# EAGLE design RetroESP32-X (EAGLE 9.6.2)

## Sheet 1 of 8: POWER (SOURCE, BATTERY, CHARGE, CONTROL)
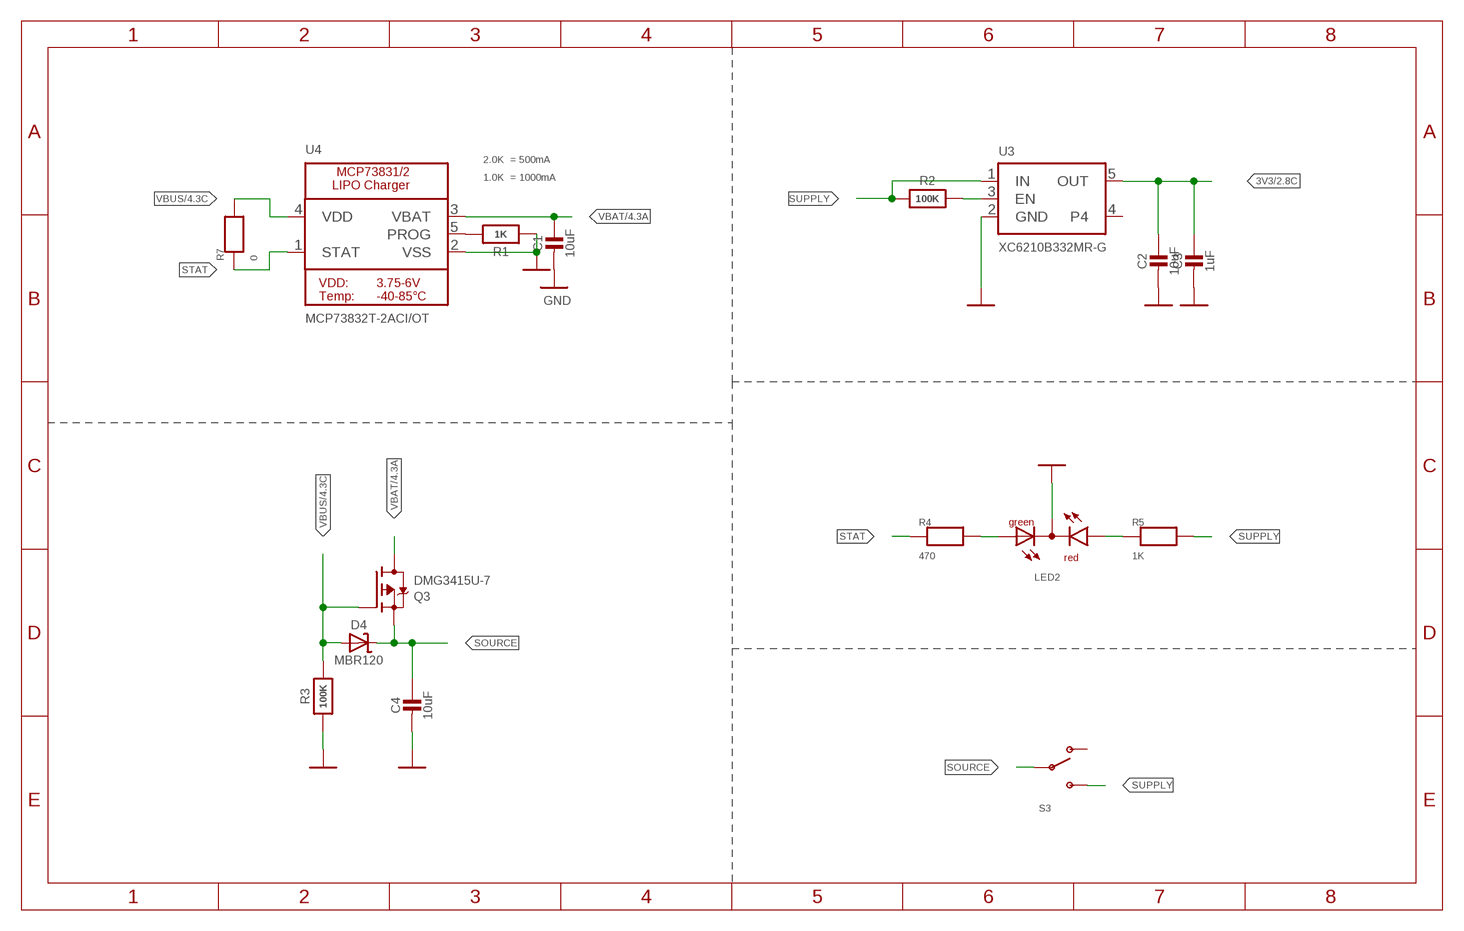
[diagram p0: schematic, sheet 1]

### Parts
C1  10uF  CAP_CERAMIC  [0603-MINI-CAP]
C2  10uF  CAP_CERAMIC  [0603-MINI-CAP]
C3  1uF  CAP_CERAMIC  [0603-MINI-CAP]
C4  10uF  CAP_CERAMIC  [0603-MINI-CAP]
D4  MBR120  DIODE-SCHOTTKYSOD-123  [SOD-123]
LED2  LED_L-115WEGW-CA  [LED_DUOLED-A-3MM]
Q3  DMG3415U-7  MOSFET-P  [SOT23-R]
R1  1K  RESISTOR0603MINI  [0603-MINI]
R2  100K  RESISTOR0603MINI  [0603-MINI]
R3  100K  RESISTOR0603MINI  [0603-MINI]
R4  470  RESISTOR0603MINI  [0603-MINI]
R5  1K  RESISTOR0603MINI  [0603-MINI]
R7  0  RESISTOR0603MINI  [0603-MINI]
S3  POWER-SWITCH  [RETIRED_KPS-1290]
U3  XC6210B332MR-G  AP2112-3.3  [SOT23-5]
U4  MCP73832T-2ACI/OT  MCP73831/2  [SOT23-5-1]

### Nets
3V3: C2.1 C3.1 U3.5(OUT) ; also sheet 2,3,4,5,6,7
EN: R2.2 U3.3(EN)
GND: C1.2 C2.2 C3.2 C4.2 LED2.2(A) R1.1 R3.1 U3.2(GND) U4.2(VSS) ; also sheet 2,3,4,5,6,7
POWER_LED: LED2.3(CR) R5.1
PROG: R1.2 U4.5(PROG)
SOURCE: C4.1 D4.C Q3.2(S) S3.P
STAT: R4.1 R7.1 U4.1(STAT)
STAT_LED: LED2.1(CG) R4.2
SUPPLY: R2.1 R5.2 S3.S U3.1(IN)
VBAT: C1.1 Q3.3(D) U4.3(VBAT) ; also sheet 4
VBUS: D4.A Q3.1(G) R3.2 R7.2 U4.4(VDD) ; also sheet 4
Unconnected: S3.O U3.4

### Notes on the sheet
- 2.0K  = 500mA
- 1.0K  = 1000mA

## Sheet 2 of 8: USB UART
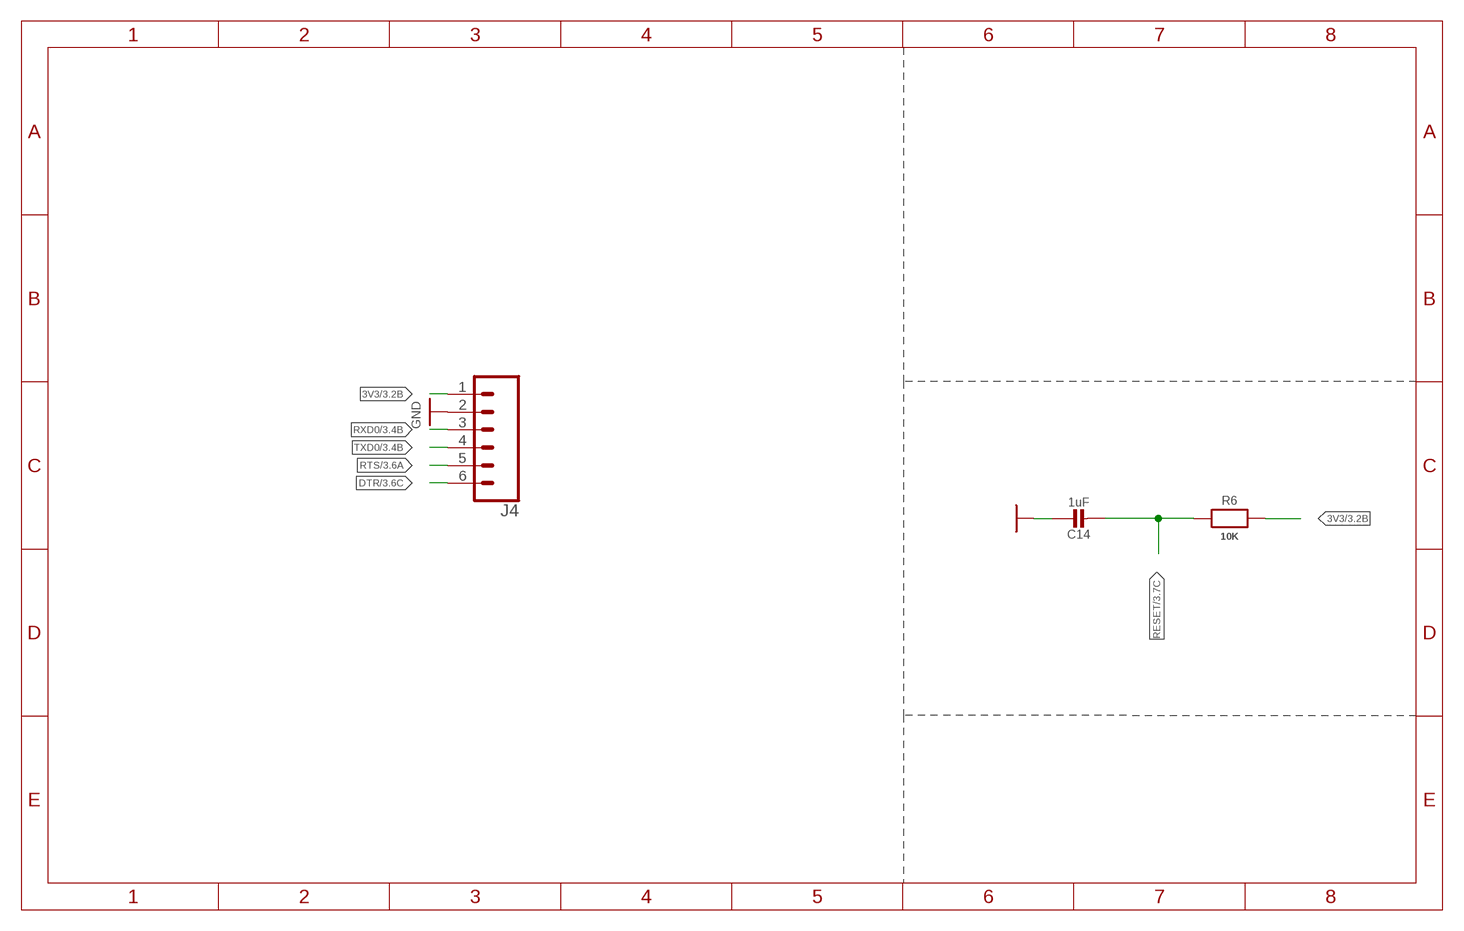
[diagram p1: schematic, sheet 2]

### Parts
C14  1uF  CAP_CERAMIC  [0603-MINI-CAP]
J4  CONN_06NO_SILK_NO_POP  [1X06_NO_SILK]
R6  10K  RESISTOR0603MINI  [0603-MINI]

### Nets
3V3: J4.1 R6.2 ; also sheet 1,3,4,5,6,7
DTR: J4.6 ; also sheet 3
GND: C14.1 J4.2 ; also sheet 1,3,4,5,6,7
RESET: C14.2 R6.1 ; also sheet 3,6
RTS: J4.5 ; also sheet 3
RXD0: J4.3 ; also sheet 3
TXD0: J4.4 ; also sheet 3

## Sheet 3 of 8: ESP32 CORE
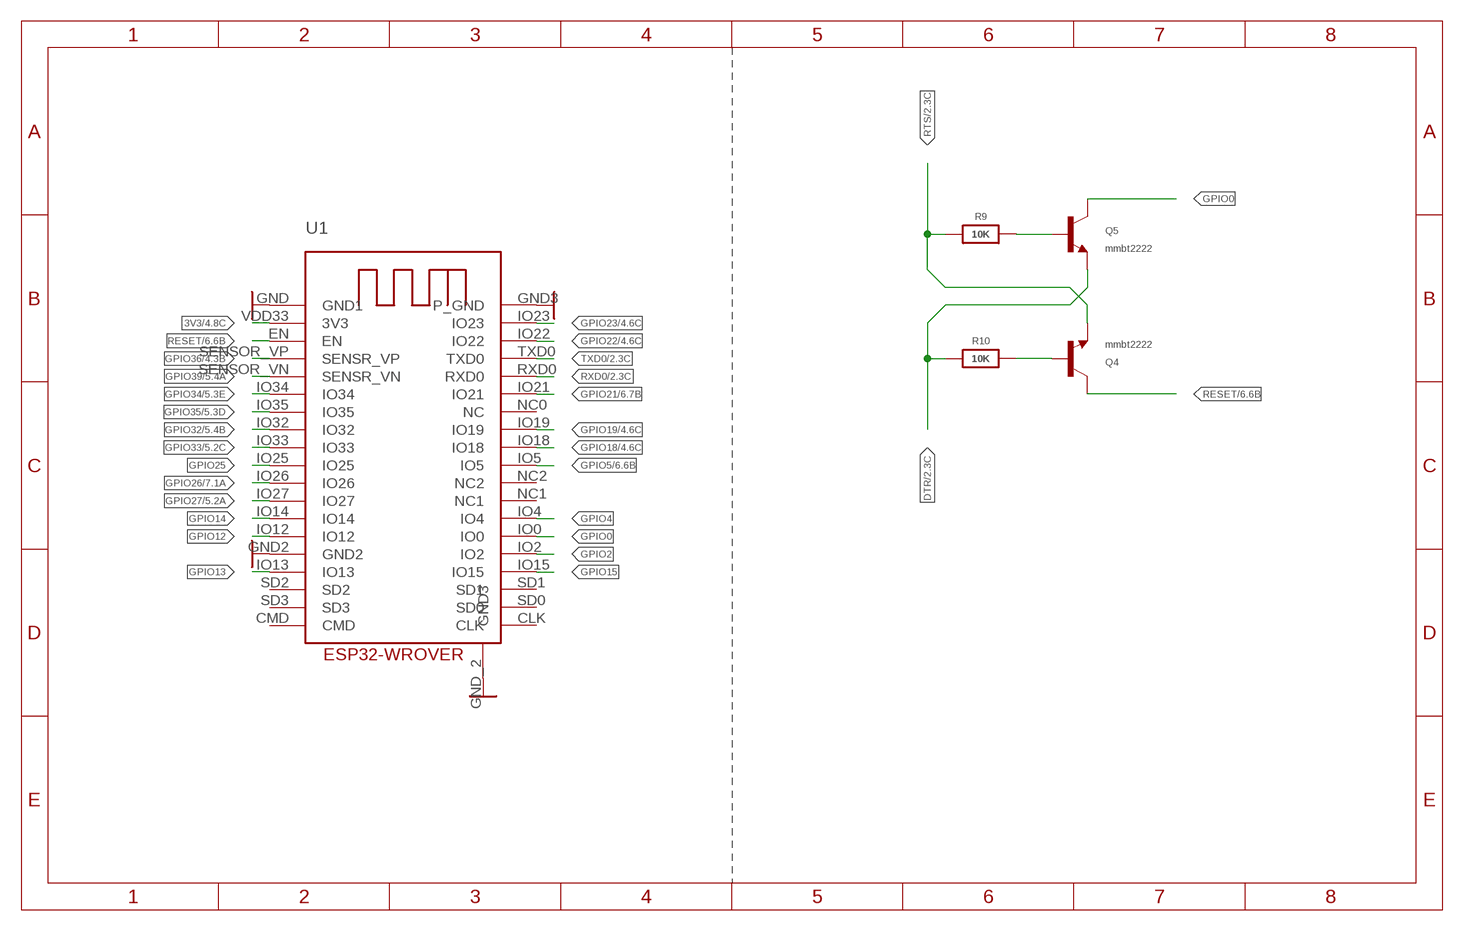
[diagram p2: schematic, sheet 3]

### Parts
Q4  mmbt2222  TRANSISTOR_NPNSOT23-3  [SOT23-3]
Q5  mmbt2222  TRANSISTOR_NPNSOT23-3  [SOT23-3]
R9  10K  RESISTOR0603MINI  [0603-MINI]
R10  10K  RESISTOR0603MINI  [0603-MINI]
U1  ESP32-WROVER  [ESP32-WROVER_ESP32-WROVER]

### Nets
3V3: U1.VDD33(3V3) ; also sheet 1,2,4,5,6,7
DTR: Q5.2(E) R10.1 ; also sheet 2
GND: U1.GND2 U1.GND3(P_GND) U1.GND(GND1) U1.GND_2(GND3) ; also sheet 1,2,4,5,6,7
GPIO0: Q5.3(C) U1.IO0
GPIO2: U1.IO2
GPIO4: U1.IO4
GPIO5: U1.IO5 ; also sheet 6
GPIO12: U1.IO12
GPIO13: U1.IO13
GPIO14: U1.IO14
GPIO15: U1.IO15
GPIO18: U1.IO18 ; also sheet 4,6
GPIO19: U1.IO19 ; also sheet 4
GPIO21: U1.IO21 ; also sheet 6
GPIO22: U1.IO22 ; also sheet 4
GPIO23: U1.IO23 ; also sheet 4,6
GPIO25: U1.IO25
GPIO26: U1.IO26 ; also sheet 7
GPIO27: U1.IO27 ; also sheet 5
GPIO32: U1.IO32 ; also sheet 5
GPIO33: U1.IO33 ; also sheet 5
GPIO34: U1.IO34 ; also sheet 5
GPIO35: U1.IO35 ; also sheet 5
GPIO36: U1.SENSOR_VP(SENSR_VP) ; also sheet 4
GPIO39: U1.SENSOR_VN(SENSR_VN) ; also sheet 5
RESET: Q4.3(C) U1.EN ; also sheet 2,6
RST-RES: Q4.1(B) R10.2
RTS: Q4.2(E) R9.1 ; also sheet 2
RTS-RES: Q5.1(B) R9.2
RXD0: U1.RXD0 ; also sheet 2
TXD0: U1.TXD0 ; also sheet 2
Unconnected: U1.CLK U1.CMD U1.NC0(NC) U1.NC1 U1.NC2 U1.SD0 U1.SD1 U1.SD2 U1.SD3

## Sheet 4 of 8: USB + BATTERY
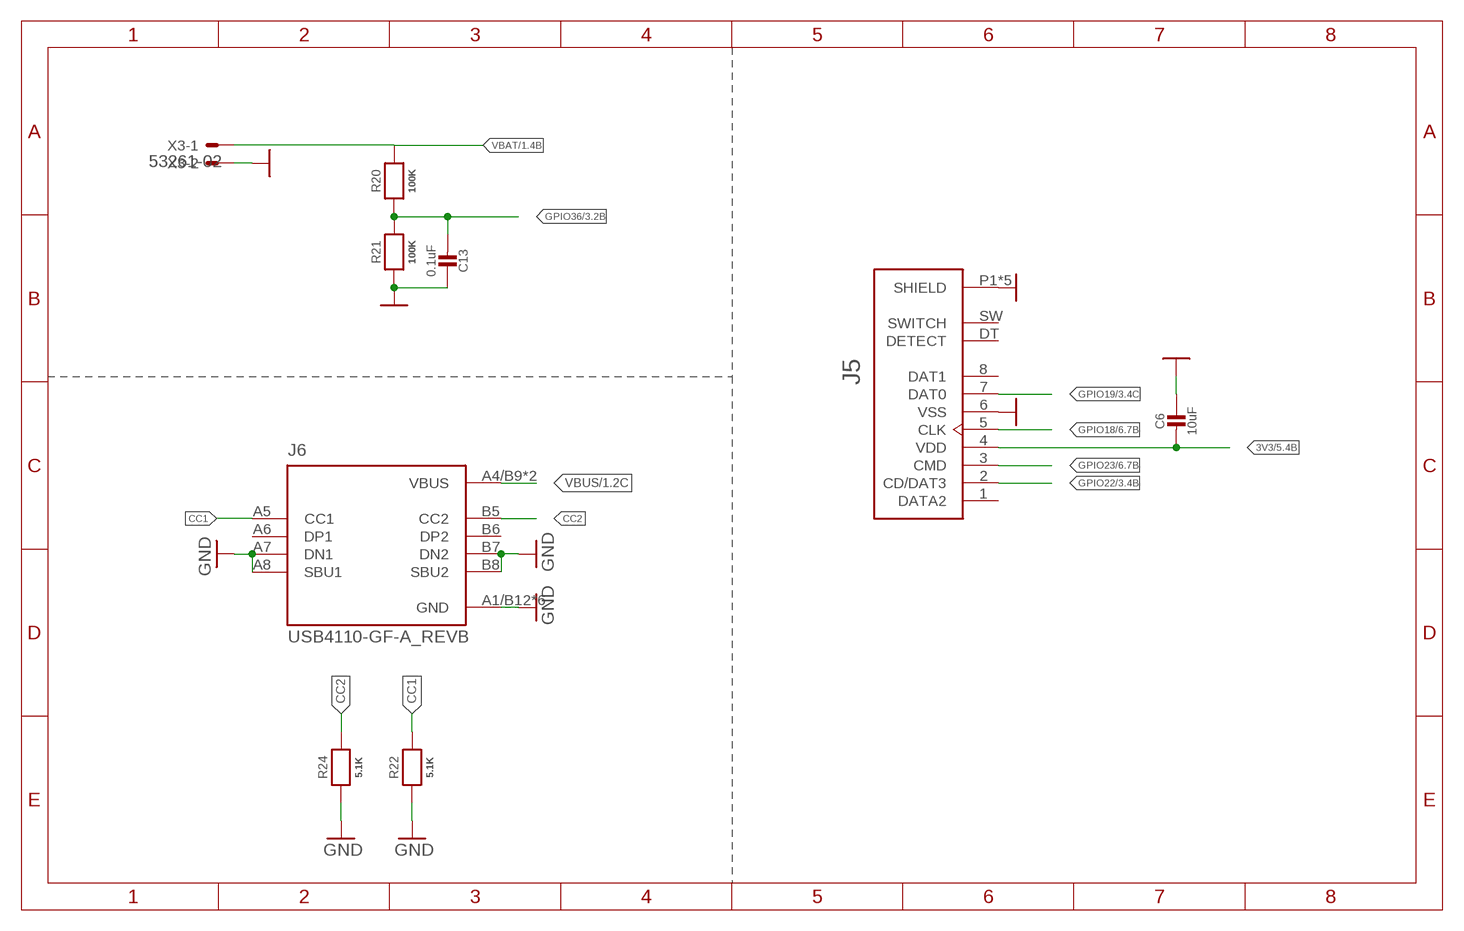
[diagram p3: schematic, sheet 4]

### Parts
C6  10uF  CAP_CERAMIC  [0603-MINI-CAP]
C13  0.1uF  CAP_CERAMIC  [0603-MINI-CAP]
J5  503182-1852_503182-1852  [503182-1852_MOLEX_503182-1852]
J6  USB4110-GF-A_REVB  [GCT_USB4110-GF-A_REVB]
R20  100K  RESISTOR0603MINI  [0603-MINI]
R21  100K  RESISTOR0603MINI  [0603-MINI]
R22  5.1K  RESISTOR0603MINI  [0603-MINI]
R24  5.1K  RESISTOR0603MINI  [0603-MINI]
X3  53261-02  [53261-02]

### Nets
3V3: C6.2 J5.4(VDD) ; also sheet 1,2,3,5,6,7
CC1: J6.A5(CC1) R22.2
CC2: J6.B5(CC2) R24.2
GND: C6.1 C13.1 J5.6(VSS) J5.P1(SHIELD) J5.P2(SHIELD) J5.P3(SHIELD) J5.P4(SHIELD) J5.P5(SHIELD) J6.A1/B12(GND) J6.A7(DN1) J6.A8(SBU1) J6.B1/A12(GND) J6.B7(DN2) J6.B8(SBU2) J6.S1(GND) J6.S2(GND) J6.S3(GND) J6.S4(GND) R21.1 R22.1 R24.1 X3.2 ; also sheet 1,2,3,5,6,7
GPIO18: J5.5(CLK) ; also sheet 3,6
GPIO19: J5.7(DAT0) ; also sheet 3
GPIO22: J5.2(CD/DAT3) ; also sheet 3
GPIO23: J5.3(CMD) ; also sheet 3,6
GPIO36: C13.2 R20.1 R21.2 ; also sheet 3
VBAT: R20.2 X3.1 ; also sheet 1
VBUS: J6.A4/B9(VBUS) J6.B4/A9(VBUS) ; also sheet 1
Unconnected: J5.1(DATA2) J5.8(DAT1) J5.DT(DETECT) J5.SW(SWITCH) J6.A6(DP1) J6.B6(DP2)

## Sheet 5 of 8: GPIO
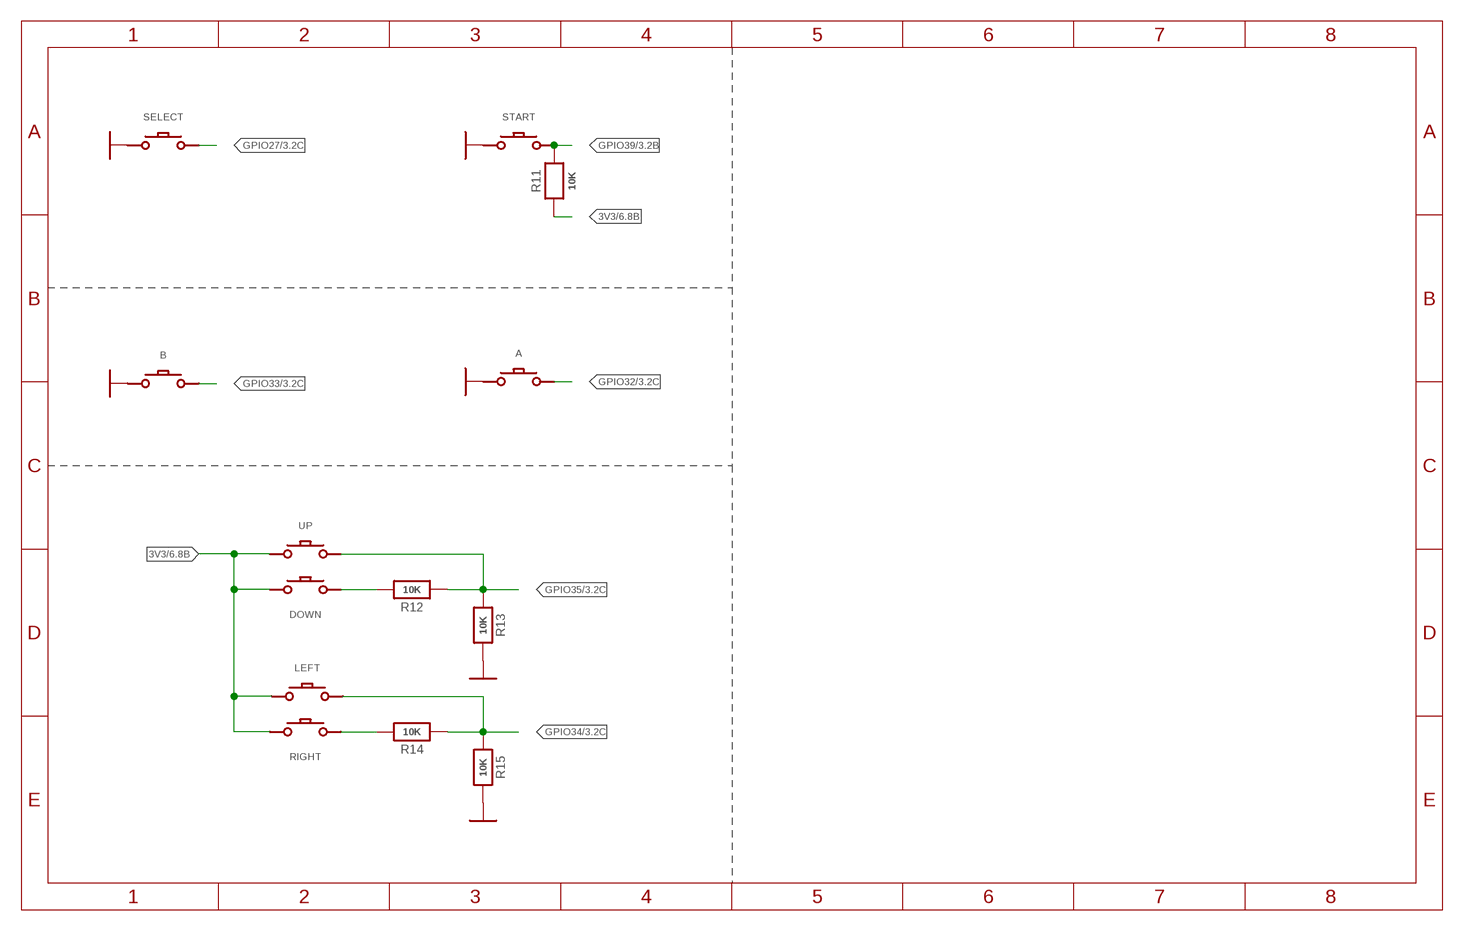
[diagram p4: schematic, sheet 5]

### Parts
A  BUTTONSCONDUCTIVE_BUTTON_MGB  [ACTION-GAMEBOY]
B  BUTTONSCONDUCTIVE_BUTTON_MGB  [ACTION-GAMEBOY]
DOWN  BUTTONSCONDUCTIVE_BUTTON_DIRECTION_THIN  [DIRECTIONAL-SPACED-PAD]
LEFT  BUTTONSCONDUCTIVE_BUTTON_DIRECTION_THIN  [DIRECTIONAL-SPACED-PAD]
R11  10K  RESISTOR0603MINI  [0603-MINI]
R12  10K  RESISTOR0603MINI  [0603-MINI]
R13  10K  RESISTOR0603MINI  [0603-MINI]
R14  10K  RESISTOR0603MINI  [0603-MINI]
R15  10K  RESISTOR0603MINI  [0603-MINI]
RIGHT  BUTTONSCONDUCTIVE_BUTTON_DIRECTION_THIN  [DIRECTIONAL-SPACED-PAD]
SELECT  BUTTON_START+SELECT  [START+SELECT-STANDARD]
START  BUTTON_START+SELECT  [START+SELECT-STANDARD]
UP  BUTTONSCONDUCTIVE_BUTTON_DIRECTION_THIN  [DIRECTIONAL-SPACED-PAD]

### Nets
3V3: DOWN.P$GND LEFT.P$GND R11.1 RIGHT.P$GND UP.P$GND ; also sheet 1,2,3,4,6,7
DOWN: DOWN.P$ACTIVE R12.2
GND: A.P$GND A.P$GND1(P$GND) B.P$GND B.P$GND1(P$GND) R13.2 R15.2 SELECT.P$GND SELECT.P$GND1(P$GND) SELECT.P$GND2(P$GND) SELECT.P$GND3(P$GND) START.P$GND START.P$GND1(P$GND) START.P$GND2(P$GND) START.P$GND3(P$GND) ; also sheet 1,2,3,4,6,7
GPIO27: SELECT.P$ACTIVE SELECT.P$ACTIVE1(P$ACTIVE) SELECT.P$ACTIVE2(P$ACTIVE) SELECT.P$ACTIVE3(P$ACTIVE) SELECT.P$ACTIVE4(P$ACTIVE) SELECT.P$ACTIVE5(P$ACTIVE) SELECT.P$ACTIVE6(P$ACTIVE) ; also sheet 3
GPIO32: A.P$ACTIVE A.P$ACTIVE1(P$ACTIVE) ; also sheet 3
GPIO33: B.P$ACTIVE B.P$ACTIVE1(P$ACTIVE) ; also sheet 3
GPIO34: LEFT.P$ACTIVE R14.1 R15.1 ; also sheet 3
GPIO35: R12.1 R13.1 UP.P$ACTIVE ; also sheet 3
GPIO39: R11.2 START.P$ACTIVE START.P$ACTIVE1(P$ACTIVE) START.P$ACTIVE2(P$ACTIVE) START.P$ACTIVE3(P$ACTIVE) START.P$ACTIVE4(P$ACTIVE) START.P$ACTIVE5(P$ACTIVE) START.P$ACTIVE6(P$ACTIVE) ; also sheet 3
RIGHT: R14.2 RIGHT.P$ACTIVE

## Sheet 6 of 8: SCREEN + BRIGHTNESS
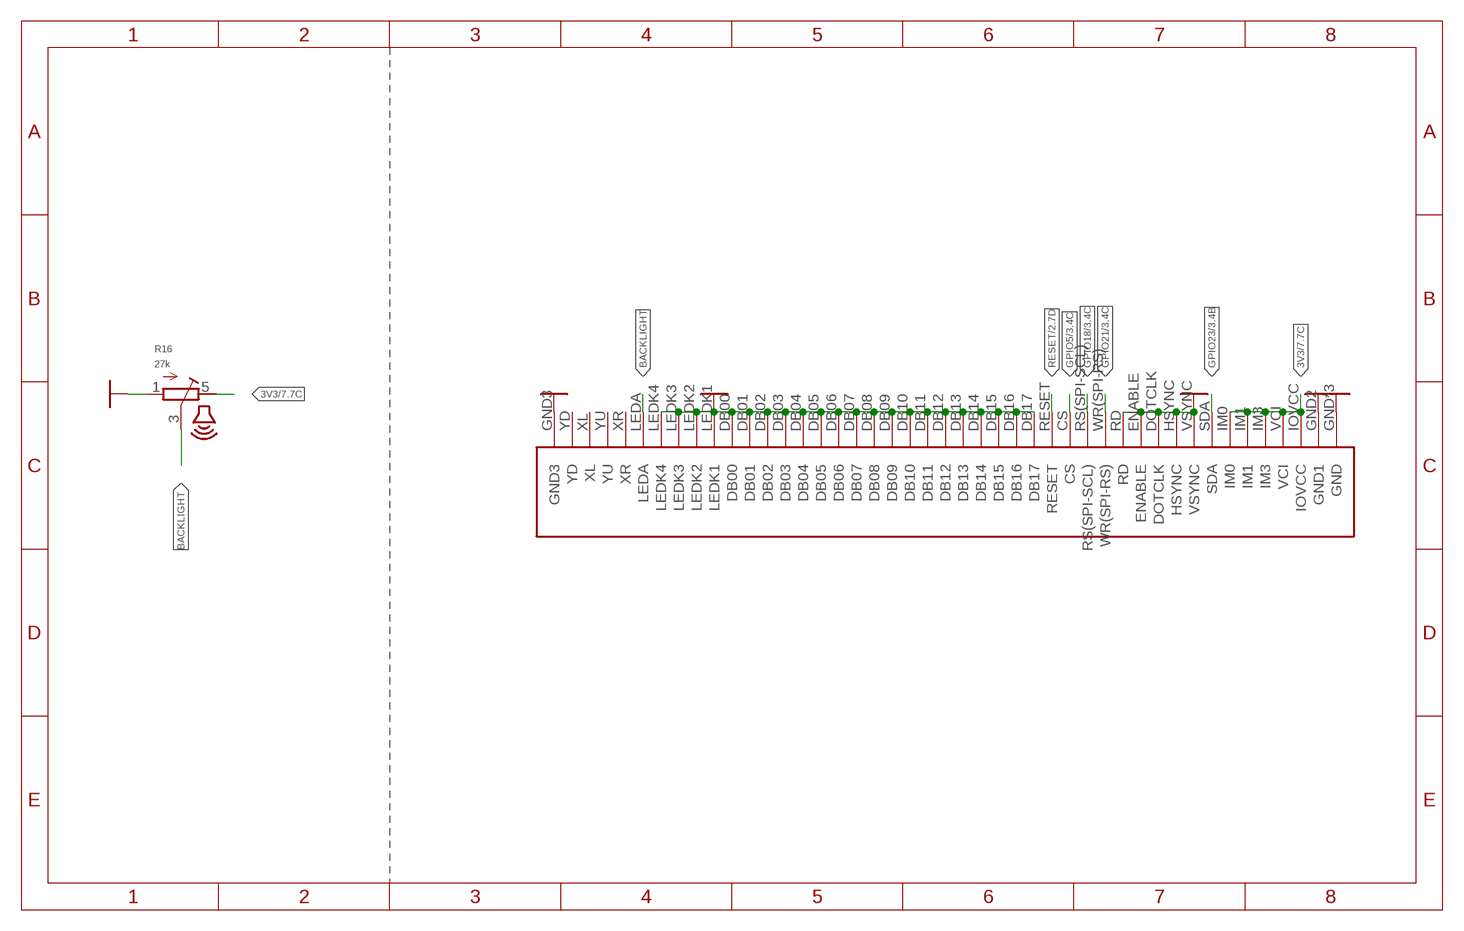
[diagram p5: schematic, sheet 6]

### Parts
R16  27k  THUMBWHEEL  [THUMBWHEEL]
U$11  LCD-ILI9342CKD026LQTMA008=PASSTHRU-2023  [KD026LQTMA008-PASSTHRU-2023]

### Nets
3V3: R16.5(E) U$11.IM0 U$11.IM1 U$11.IM3 U$11.IOVCC U$11.VCI ; also sheet 1,2,3,4,5,7
BACKLIGHT: R16.3(S) U$11.LEDA
GND: R16.1(A) U$11.DB00 U$11.DB01 U$11.DB02 U$11.DB03 U$11.DB04 U$11.DB05 U$11.DB06 U$11.DB07 U$11.DB08 U$11.DB09 U$11.DB10 U$11.DB11 U$11.DB12 U$11.DB13 U$11.DB14 U$11.DB15 U$11.DB16 U$11.DB17 U$11.DOTCLK U$11.ENABLE U$11.GND U$11.GND2(GND1) U$11.GND3 U$11.HSYNC U$11.LEDK1 U$11.LEDK2 U$11.LEDK3 U$11.LEDK4 U$11.PAD$1(GND) U$11.PAD$2(GND) U$11.RD U$11.VSYNC ; also sheet 1,2,3,4,5,7
GPIO5: U$11.CS ; also sheet 3
GPIO18: U$11.RS(SPI-SCL) ; also sheet 3,4
GPIO21: U$11.WR(SPI-RS) ; also sheet 3
GPIO23: U$11.SDA ; also sheet 3,4
RESET: U$11.RESET ; also sheet 2,3
Unconnected: U$11.XL U$11.XR U$11.YD U$11.YU

## Sheet 7 of 8: AUDIO
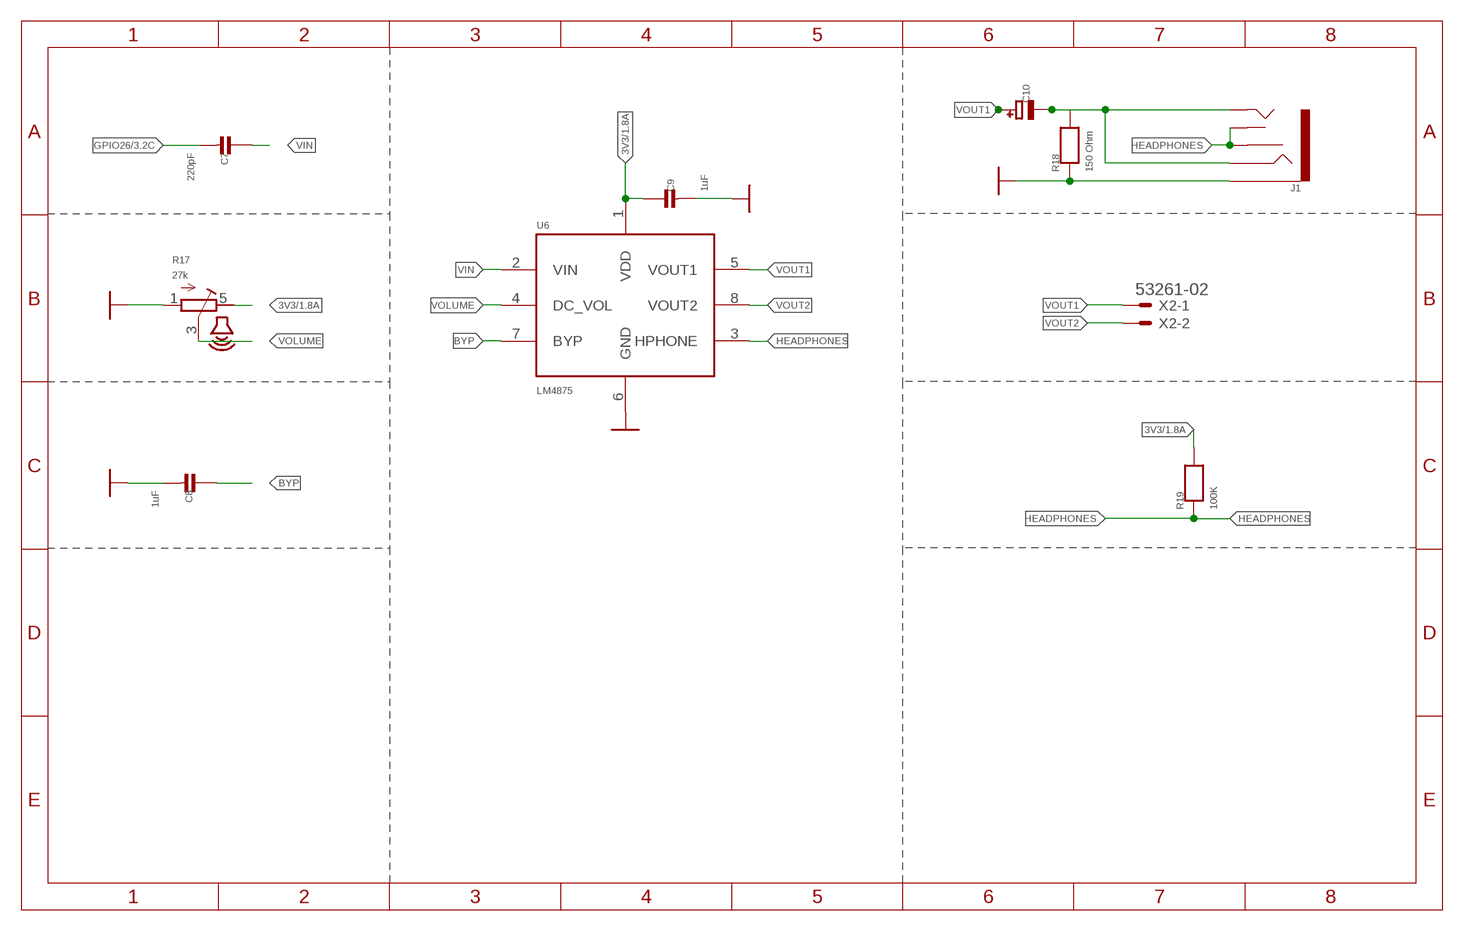
[diagram p6: schematic, sheet 7]

### Parts
C7  220pF  CAP_CERAMIC  [0603-MINI-CAP]
C8  1uF  CAP_CERAMIC  [0603-MINI-CAP]
C9  1uF  CAP_CERAMIC  [0603-MINI-CAP]
C10  100uF  CAP_TANTALUMA/3216_WAVE  [EIA3216-18/A-W]
J1  AUDIO_JACK_3.5MM_KIT  [AUDIO-JACK-KIT]
R17  27k  THUMBWHEEL  [THUMBWHEEL]
R18  150 Ohm  RESISTOR0603MINI  [0603-MINI]
R19  100K  RESISTOR0603MINI  [0603-MINI]
U6  LM4875  [SOIC8]
X2  53261-02  [53261-02]

### Nets
3V3: C9.1 R17.5(E) R19.2 U6.1(VDD) ; also sheet 1,2,3,4,5,6
BYP: C8.1 U6.7(BYP)
GND: C8.2 C9.2 J1.SLEEVE R17.1(A) R18.1 U6.6(GND) ; also sheet 1,2,3,4,5,6
GPIO26: C7.2 ; also sheet 3
HEADPHONES: J1.RSH J1.TSH R19.1 U6.3(HPHONE)
VIN: C7.1 U6.2(VIN)
VIN1: C10.- J1.RING J1.TIP R18.2
VOLUME: R17.3(S) U6.4(DC_VOL)
VOUT1: C10.+ U6.5(VOUT1) X2.1
VOUT2: U6.8(VOUT2) X2.2

## Sheet 8 of 8: Board and Logos
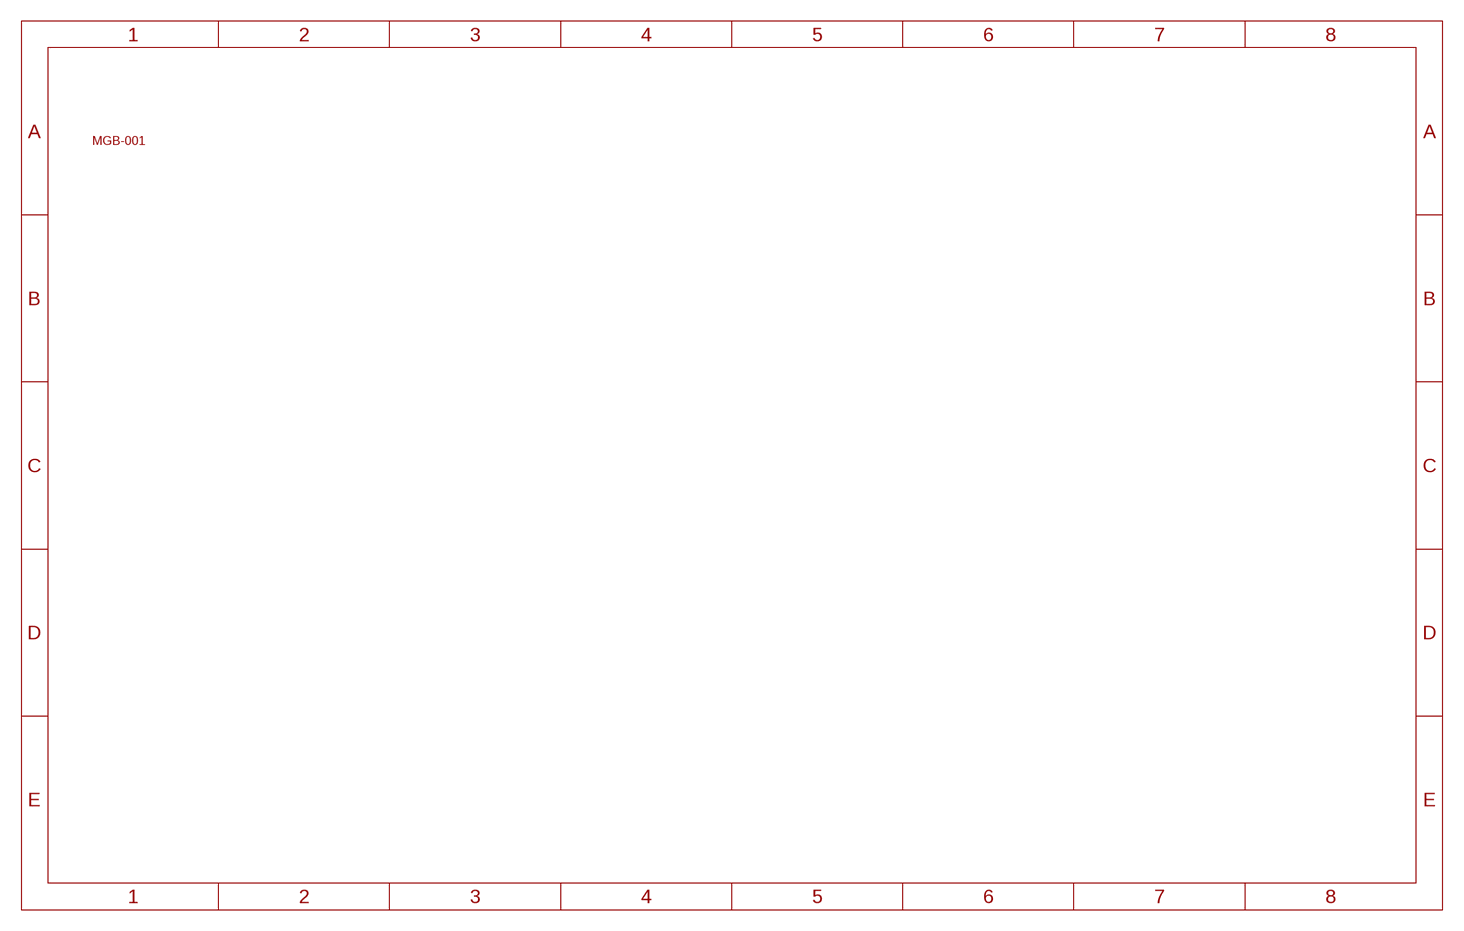
[diagram p7: schematic, sheet 8]

### Parts
U$17  POCKET-BOARDSMGB-001-ESP32-2023  [MGB-001-ESP32-2023]

## Library data of the parts
A DOWN LEFT RIGHT UP = RetroESP32:BUTTONS; IGNORE_BOM: TRUE
B = RetroESP32:BUTTONS; IGNORE_BOM: TRUE; SPICEPREFIX: B
C1 C2 C4 C6 = RetroESP32:CAP_CERAMIC: Ceramic Capacitors For new designs, use the packages preceded by an '_' character since they are more reliable: The following footprints should be used on most boards: _0402 - Standard footprint for regular board layouts _0603 - Standard footprint for regular board layouts _0805 - Standard footprint for regular board layouts _1206 - Standard footprint for regular board layouts For extremely tight-pitch boards where space is at a premium, the following 'micro-pitch' footprints can be used (smaller pads, no silkscreen outline, etc.): _0402MP - Micro-pitch footprint for very dense/compact boards _0603MP - Micro-pitch footprint for very dense/compact boards _0805MP - Micro-pitch footprint for very dense/compact boards _1206MP - Micro-pitch footprint for very dense/compact boards; MPN: CL10A106MP8NNNC
C3 C8 C9 C14 = RetroESP32:CAP_CERAMIC: Ceramic Capacitors For new designs, use the packages preceded by an '_' character since they are more reliable: The following footprints should be used on most boards: _0402 - Standard footprint for regular board layouts _0603 - Standard footprint for regular board layouts _0805 - Standard footprint for regular board layouts _1206 - Standard footprint for regular board layouts For extremely tight-pitch boards where space is at a premium, the following 'micro-pitch' footprints can be used (smaller pads, no silkscreen outline, etc.): _0402MP - Micro-pitch footprint for very dense/compact boards _0603MP - Micro-pitch footprint for very dense/compact boards _0805MP - Micro-pitch footprint for very dense/compact boards _1206MP - Micro-pitch footprint for very dense/compact boards; MPN: CL10A105KP8NNNC
C7 = RetroESP32:CAP_CERAMIC: Ceramic Capacitors For new designs, use the packages preceded by an '_' character since they are more reliable: The following footprints should be used on most boards: _0402 - Standard footprint for regular board layouts _0603 - Standard footprint for regular board layouts _0805 - Standard footprint for regular board layouts _1206 - Standard footprint for regular board layouts For extremely tight-pitch boards where space is at a premium, the following 'micro-pitch' footprints can be used (smaller pads, no silkscreen outline, etc.): _0402MP - Micro-pitch footprint for very dense/compact boards _0603MP - Micro-pitch footprint for very dense/compact boards _0805MP - Micro-pitch footprint for very dense/compact boards _1206MP - Micro-pitch footprint for very dense/compact boards; MPN: CL10C221JB8NNNC
C10 = RetroESP32:CAP_TANTALUM: Tantalum Capacitors Wave footprints have larger pads and are meant to be used for hand soldering. Reflow footprints are optimised for solder paste and a reflow oven. EIA3216-18/A-[R/W] - Size A / 3216-18 / 1206 footprint 4.7µF 25V 10% Tantalum Capacitor 10µF 16V 10% Tantalum Capacitor [Digikey: 495-2236-2-ND] EIA3528-21/B-[R/W] - Size B / 3528-21 47µF 10V 10% Tantalum Capactior [Digikey: 495-2216-1-ND] EIA6032-28/C-[R/W] - Size C / 6032-28 10µF 35V 20% Tantalum Capacitor [Digikey: 495-2285-1-ND] 100µF 16V 10% Tantalum Capactior [Digikey: 399-5214-1-ND]; MPN: F930J107KAA
C13 = RetroESP32:CAP_CERAMIC: Ceramic Capacitors For new designs, use the packages preceded by an '_' character since they are more reliable: The following footprints should be used on most boards: _0402 - Standard footprint for regular board layouts _0603 - Standard footprint for regular board layouts _0805 - Standard footprint for regular board layouts _1206 - Standard footprint for regular board layouts For extremely tight-pitch boards where space is at a premium, the following 'micro-pitch' footprints can be used (smaller pads, no silkscreen outline, etc.): _0402MP - Micro-pitch footprint for very dense/compact boards _0603MP - Micro-pitch footprint for very dense/compact boards _0805MP - Micro-pitch footprint for very dense/compact boards _1206MP - Micro-pitch footprint for very dense/compact boards; MPN: CL10B104KB8NNNC
D4 = RetroESP32:DIODE-SCHOTTKY; MPN: MBR120LSFT1G
J1 = RetroESP32:AUDIO_JACK_3.5MM: Audio Jack 3.5mm variants of PTH and SMT stereo audio jack with bypass switches. SparkFun Products: SparkFun SparkPunk Sound Kit <[https://www.sparkfun.com/products/11177]> - PTH MP3 Trigger <https://www.sparkfun.com/products/13720> -3.5mm SMD SparkFun PicoBoard <https://www.sparkfun.com/products/11888>- 2.5mm SMD; MPN: SJ1-3525NG-GR; PROD_ID: CONN-10353; SF_ID: PRT-08032
J4 = SparkFun-Connectors:CONN_06: Multi connection point. Often used as Generic Header-pin footprint for 0.1 inch spaced/style header connections On any of the 0.1 inch spaced packages, you can populate with these: Break Away Headers - Straight <https://www.sparkfun.com/products/116> (PRT-00116) Break Away Male Headers - Right Angle <https://www.sparkfun.com/products/553> (PRT-00553) Female Headers <https://www.sparkfun.com/products/115> (PRT-00115) Break Away Headers - Machine Pin <https://www.sparkfun.com/products/117> (PRT-00117) Break Away Female Headers - Swiss Machine Pin <https://www.sparkfun.com/products/743> (PRT-00743) Arduino Stackable Header - 6 Pin <https://www.sparkfun.com/products/9280> (PRT-09280) For SCREWTERMINALS and SPRING TERMINALS visit here: Screw Terimnals on SparkFun.com <https://www.sparkfun.com/search/results?term=Screw+Terminals> (5mm/3.5mm/2.54mm spacing) This device is also useful as a general connection point to wire up your design to another part of your project. Our various solder wires solder well into these plated through hole pads. Hook-Up Wire - Assortment (Stranded, 22 AWG) <https://www.sparkfun.com/products/11375> (PRT-11375) Hook-Up Wire - Assortment (Solid Core, 22 AWG) <https://www.sparkfun.com/products/11367> (PRT-11367) View the entire wire category on our website here <https://www.sparkfun.com/categories/141>
J5 = RetroESP32:503182-1852_503182-1852: Conn Micro SD Card M 8 POS 1.09mm Solder RA SMD Embossed T/R 0.5A/Contact; DESCRIPTION: MICRO SD NORMAL ULTRALOWPRO8CKTE; DIGI-KEY_PART_NUMBER: WM12834CT-ND; DIGI-KEY_PURCHASE_URL: https://www.digikey.ca/product-detail/en/molex/5031821852/WM12834CT-ND/5823232?utm_source=snapeda&utm_medium=aggregator&utm_campaign=symbol; MF: Molex; MP: 5031821852; MPN: 5031821852; PACKAGE: None
J6 = USB4110-GF-A:USB4110-GF-A_REVB: Check availability <https://pricing.snapeda.com/parts/USB4110-GF-A/GCT/view-part?ref=eda>; AVAILABILITY: In Stock; DESCRIPTION: USB-C (USB TYPE-C) USB 2.0 Receptacle Connector 24 (16+8 Dummy) Position Surface Mount, Right Angle; Through Hole; MF: GCT; MP: USB4110-GF-A; MPN: USB4105-GF-A; PACKAGE: None; PRICE: None; PURCHASE-URL: https://pricing.snapeda.com/search/part/USB4110-GF-A/?ref=eda
LED2 = RetroESP32:LED_L-115WEGW-CA: T-1(3mm) BI-COLOR INDICATOR LAMP Source: Kingbright .. 2_colour_led_.pdf; MPN: SSL-LX3059IGW
Q3 = RetroESP32:MOSFET-P: P-Channel Mosfet LEGEND VDS: Voltage Drain-Source ID: Drain Current RDS(ON): Drain-Source On-State Resistance VGS(TH): Gate-Source Threshold Voltage CISS: Drain-Source Input Capacitance SOT-23 Name VDS ID RDS(ON) VGS(TH) CISS Order Number IRLML5103 30V 760mA 600 mOhm -- 75pF @ 25V Digikey: IRLML5103PBFCT-ND IRLML6401 12V 4.3A 50 mOhm 950mV @ 250µA 830pF @ 10V Digikey: IRLML6401PBFTR-ND NTR0202PL 20V 400mA 800 mOhm 2.3V @ 250uA 70pF @ 5V Digikey: NTR0202PLT1GOSTR-ND NTR4101PT1G 20V 1.8A 85 mOhm 1.2V @ 250uA 675pF @ 10V Digikey: NTR4101PT1GOSCT-ND DMP2004K 20V 600mA 900 mOhm 1V @ 250uA 175pF @ 16V Digikey: DMP2004KDICT-ND PMV65XP 20V 3.9A 76 mOhm 950mV @ 1mA 725pF @ 20V Digikey: 568-2358-2-ND TO-252 Name VDS ID RDS(ON) VGS(TH) CISS Order Number AOD417 30V 25A 34 mOhm 3V @ 250µA 920pF @ 15V Digikey: 785-1106-2-ND; MPN: DMG3415U-7
Q4 Q5 = RetroESP32:TRANSISTOR_NPN: Transistor NPN BJT configuration in SOT23 package. MMBT2222 is the common NPN we use. Double check BCE configuration again layout.; MPN: MMBT2222A-7-F
R1 R5 = RetroESP32:RESISTOR: Resistors For new designs, use the packages preceded by an '_' character since they are more reliable: The following footprints should be used on most boards: _0402 - Standard footprint for regular board layouts _0603 - Standard footprint for regular board layouts _0805 - Standard footprint for regular board layouts _1206 - Standard footprint for regular board layouts For extremely tight-pitch boards where space is at a premium, the following 'micro-pitch' footprints can be used (smaller pads, no silkscreen outline, etc.): _0402MP - Micro-pitch footprint for very dense/compact boards _0603MP - Micro-pitch footprint for very dense/compact boards _0805MP - Micro-pitch footprint for very dense/compact boards _1206MP - Micro-pitch footprint for very dense/compact boards; MPN: ERJ-PA3J102V
R2 R3 R19-R21 = RetroESP32:RESISTOR: Resistors For new designs, use the packages preceded by an '_' character since they are more reliable: The following footprints should be used on most boards: _0402 - Standard footprint for regular board layouts _0603 - Standard footprint for regular board layouts _0805 - Standard footprint for regular board layouts _1206 - Standard footprint for regular board layouts For extremely tight-pitch boards where space is at a premium, the following 'micro-pitch' footprints can be used (smaller pads, no silkscreen outline, etc.): _0402MP - Micro-pitch footprint for very dense/compact boards _0603MP - Micro-pitch footprint for very dense/compact boards _0805MP - Micro-pitch footprint for very dense/compact boards _1206MP - Micro-pitch footprint for very dense/compact boards; MPN: ERJ-PA3J104V
R4 = RetroESP32:RESISTOR: Resistors For new designs, use the packages preceded by an '_' character since they are more reliable: The following footprints should be used on most boards: _0402 - Standard footprint for regular board layouts _0603 - Standard footprint for regular board layouts _0805 - Standard footprint for regular board layouts _1206 - Standard footprint for regular board layouts For extremely tight-pitch boards where space is at a premium, the following 'micro-pitch' footprints can be used (smaller pads, no silkscreen outline, etc.): _0402MP - Micro-pitch footprint for very dense/compact boards _0603MP - Micro-pitch footprint for very dense/compact boards _0805MP - Micro-pitch footprint for very dense/compact boards _1206MP - Micro-pitch footprint for very dense/compact boards; MPN: ERJ-PA3J471V
R6 R9-R15 = RetroESP32:RESISTOR: Resistors For new designs, use the packages preceded by an '_' character since they are more reliable: The following footprints should be used on most boards: _0402 - Standard footprint for regular board layouts _0603 - Standard footprint for regular board layouts _0805 - Standard footprint for regular board layouts _1206 - Standard footprint for regular board layouts For extremely tight-pitch boards where space is at a premium, the following 'micro-pitch' footprints can be used (smaller pads, no silkscreen outline, etc.): _0402MP - Micro-pitch footprint for very dense/compact boards _0603MP - Micro-pitch footprint for very dense/compact boards _0805MP - Micro-pitch footprint for very dense/compact boards _1206MP - Micro-pitch footprint for very dense/compact boards; MPN: ERJ-PA3J103V
R7 = RetroESP32:RESISTOR: Resistors For new designs, use the packages preceded by an '_' character since they are more reliable: The following footprints should be used on most boards: _0402 - Standard footprint for regular board layouts _0603 - Standard footprint for regular board layouts _0805 - Standard footprint for regular board layouts _1206 - Standard footprint for regular board layouts For extremely tight-pitch boards where space is at a premium, the following 'micro-pitch' footprints can be used (smaller pads, no silkscreen outline, etc.): _0402MP - Micro-pitch footprint for very dense/compact boards _0603MP - Micro-pitch footprint for very dense/compact boards _0805MP - Micro-pitch footprint for very dense/compact boards _1206MP - Micro-pitch footprint for very dense/compact boards; MPN: ERJ-3GEY0R00V
R16 R17 = RetroESP32:THUMBWHEEL
R18 = RetroESP32:RESISTOR: Resistors For new designs, use the packages preceded by an '_' character since they are more reliable: The following footprints should be used on most boards: _0402 - Standard footprint for regular board layouts _0603 - Standard footprint for regular board layouts _0805 - Standard footprint for regular board layouts _1206 - Standard footprint for regular board layouts For extremely tight-pitch boards where space is at a premium, the following 'micro-pitch' footprints can be used (smaller pads, no silkscreen outline, etc.): _0402MP - Micro-pitch footprint for very dense/compact boards _0603MP - Micro-pitch footprint for very dense/compact boards _0805MP - Micro-pitch footprint for very dense/compact boards _1206MP - Micro-pitch footprint for very dense/compact boards; MPN: ERJ-PA3J151V
R22 R24 = RetroESP32:RESISTOR: Resistors For new designs, use the packages preceded by an '_' character since they are more reliable: The following footprints should be used on most boards: _0402 - Standard footprint for regular board layouts _0603 - Standard footprint for regular board layouts _0805 - Standard footprint for regular board layouts _1206 - Standard footprint for regular board layouts For extremely tight-pitch boards where space is at a premium, the following 'micro-pitch' footprints can be used (smaller pads, no silkscreen outline, etc.): _0402MP - Micro-pitch footprint for very dense/compact boards _0603MP - Micro-pitch footprint for very dense/compact boards _0805MP - Micro-pitch footprint for very dense/compact boards _1206MP - Micro-pitch footprint for very dense/compact boards; MPN: ERJ-PA3F5101V
S3 = RetroESP32:POWER-SWITCH: SWCH-10651 Side-actuated SPDT slide switch, as used on the Arduino Pro; MPN: MA12RTR; PROD_ID: SWITCH SLIDE SPDT 300MA 4V
SELECT START = RetroESP32:BUTTON_START+SELECT; IGNORE_BOM: TRUE
U1 = RetroESP32:ESP32-WROVER; MPN: ESP32-WROVER (16MB)
U3 = RetroESP32:AP2112-3.3: SOT23-5 Fixed Voltage Regulators To better organise some of the SOT23-5 fixed voltage regulators in this library, this new part was created. Part Current Out V Out V In V Dropout Digikey Part No. ADP121 150mA 3.3V 3.4-5.5V 0.09V @ 150mA ADP121-AUJZ33R7CT-ND ADP121 150mA 3.0V 3.1-5.5V 0.09V @ 150mA ADP121-AUJZ30R7CT-ND ADP122 300mA 3.3V 3.4-5.5V 0.085V @ 300mA ADP122AUJZ-3.3-R7CT-ND ADP1712 300mA 3.3V 3.5-5.5V 0.17V @ 300mA ADP1712AUJZ-3.3-R7TR-ND AP7311 (Low Cost) 150mA 3.3V 3.5-6V 0.15V @ 150mA AP7311-33WG-7DICT-ND LD39015M18R 150mA 1.8V 1.9V-5.5V 0.08V @ 100mA 497-6977-1-ND MCP1824T-3302E/OT 300mA 3.3V 3.5V-6V 0.2V @ 300mA MCP1824T-3302E/OTCT-ND MIC5205-2.5YM5 TR 150mA 2.5V 2.7-16V 0.165V @ 150mA 576-1257-2-ND MIC5205-3.0YM5 TR 150mA 3.0V 3.2V-16V 0.165V @ 150mA 576-1258-2-ND MIC5205-3.3YM5 TR 150mA 3.3V 3.5V-16V 0.165V @ 150mA 576-1259-2-ND TPS780330220 150mA 3.3V+2.2V 3.6-5.5V 250mV Max 296-23332-1-ND TDA3663/N1,135 100mA 3.3V 3.5-45V 0.18V @ 50mA 568-5343-1-ND; MPN: XC6210B332MR-G
U4 = RetroESP32:MCP73831/2: MCP73831/2 LIPO Charger VDD: 3.75 - 6V Temp -40 - 85°C Programmable Charge Rate: 15-500mA NOTE: STAT is a tri-state logic output on the MCP73831 and an open-drain output on the MCP73832. SOT23-5 with 4.2V output and tri-state logic on STAT = MCP73831T-2ACI/OT; MPN: MCP73832T-2ACI/OT
U6 = RetroESP32:LM4875; MPN: LM4875MX/NOPB
U$11 = RetroESP32:LCD-ILI9342C; MPN: 0541044531
U$17 = RetroESP32:POCKET-BOARDS: MGB-001 Game Boy Pocket This is the footprint and dimensions outline for the Game Boy Pocket PCB Variants MGB-001 - Standard Game Boy Pocket MGB-001-ESP32 - Game Boy Pocket w/ Antenna Cut Out
X2 X3 = con-molex:53?-02: CONNECTOR wire to board 1.25 mm (.049 inch) pitch header; MF: MOLEX; MPN: 0532614002; OC_FARNELL: 1125373; OC_NEWARK: unknown

## Board
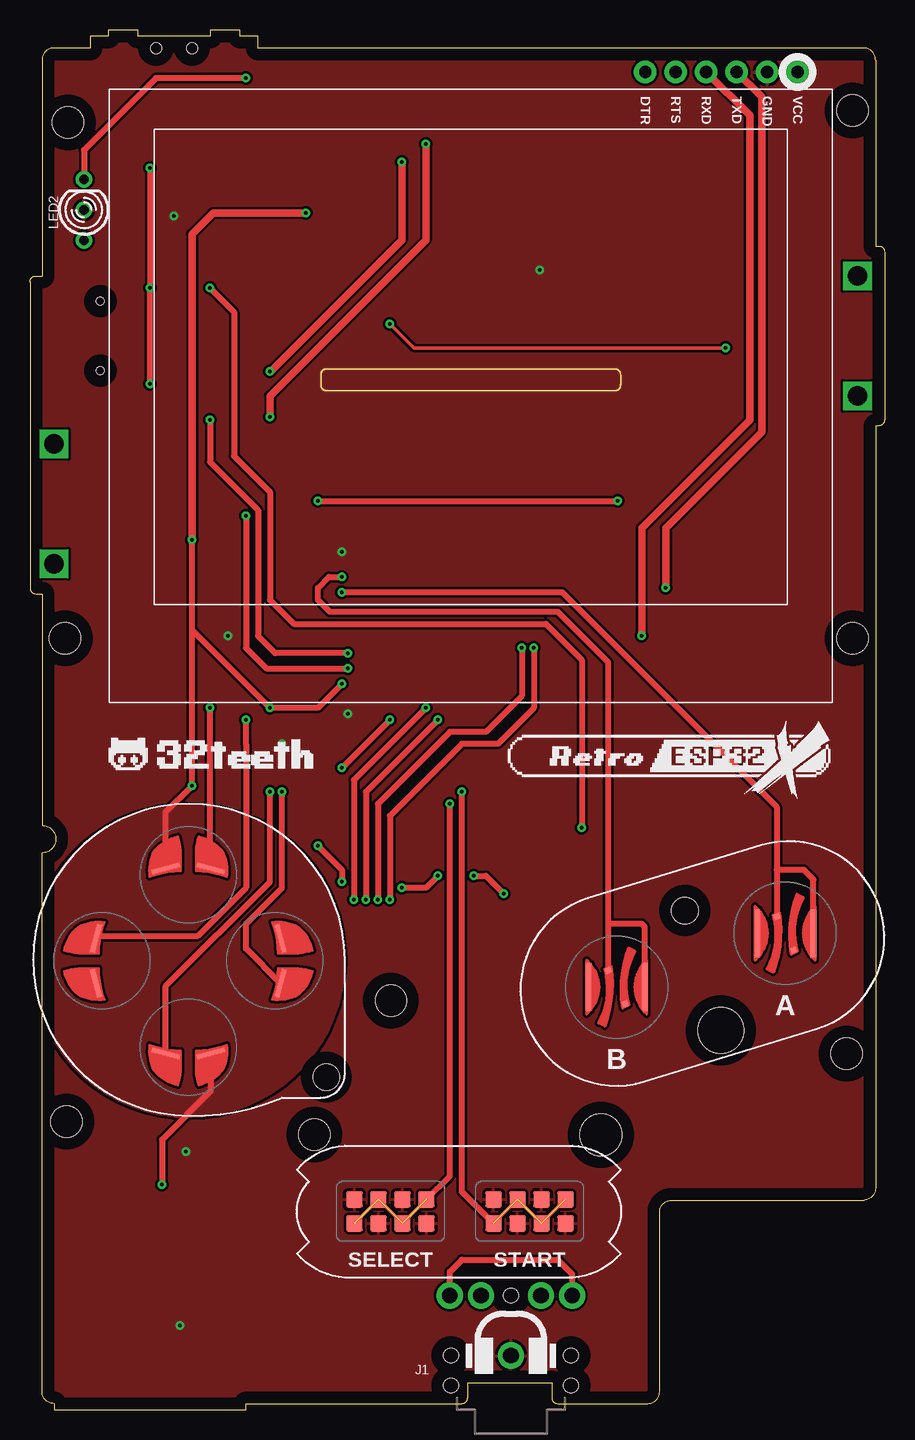
[diagram p8: board, top side]
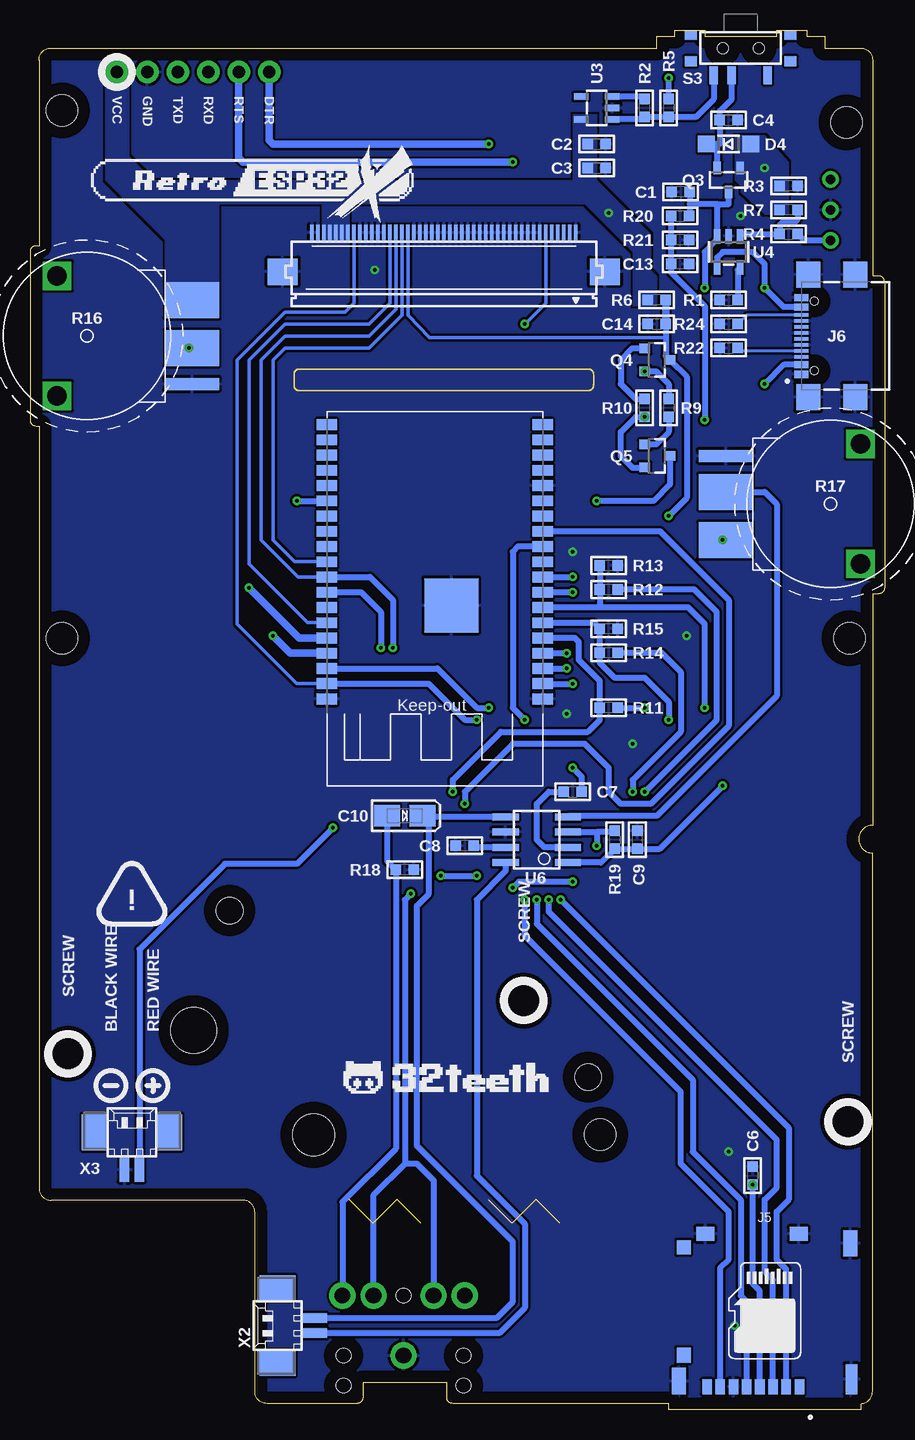
[diagram p9: board, bottom side, seen from below]

Size 71.25 x 115 mm. Coordinates in mm from the lower left corner, seen from the top.
Copper layers (1*16): Top 0.035mm / dielectric 1mm / Bottom 0.035mm
Design rules "default *": minimum track width 10mil, minimum drill 24mil, track to track 8mil, track to pad 8mil, pad to pad 8mil, via to via 8mil, smd to smd 8mil, copper to edge 40mil, drill to drill 8mil, minimum pad ring 10mil, minimum via ring 8mil, stop-mask expansion 5mil, vias tented up to drill 10mil, thermal gap 10mil

### Footprints (pad centres in the part's own frame; a part is rotated, then mirrored left to right if it is on the bottom)
ACTION-GAMEBOY = smd 0.5 x 4: P$ACTIVE -2.35,0; P$GND 2.35,0 | smd 0.5 x 0.5 rotated 290: P$ACTIVE1 0.7,-1.4 | smd 0.5 x 0.5 rotated 110: P$GND1 -0.7,1.4
0603-MINI-CAP = smd 0.9 x 0.9: 1 -0.75,0; 2 0.75,0
EIA3216-18/A-W = smd 2.15 x 1.8: + 1.475,0; - -1.475,0
SOD-123 = smd 1.4 x 1.4: A 1.85,0; C -1.85,0
DIRECTIONAL-SPACED-PAD = smd 2.4 x 0.4 rotated 75: P$ACTIVE -0.5,1.873 | smd 2.4 x 0.4 rotated 285: P$GND -0.5,-1.873
AUDIO-JACK-KIT = drill 1.3 pad 2.184: RING 5,5.1; RSH 5,2.5; SLEEVE 0,0; TIP 5,-5.1; TSH 5,-2.5 | hole 1.2: 0,5; -2.5,5; -2.5,-5; 0,-5; 5,0
1X06_NO_SILK = drill 1.016 pad 1.88: 1 0,0; 2 2.54,0; 3 5.08,0; 4 7.62,0; 5 10.16,0; 6 12.7,0
503182-1852_MOLEX_503182-1852 = smd 0.8 x 1.24: 1 -2.9,6.355; 2 -1.8,6.355; 3 -0.7,6.355; 4 0.4,6.355; 5 1.5,6.355; 6 2.6,6.355; 7 3.7,6.355; 8 4.8,6.355 | smd 1.16 x 1.2: DT 6.74,-5.275 | smd 0.95 x 2.5: P1 -7.245,5.725 | smd 1.15 x 2.2: P2 7.145,5.875; P3 -7.145,-5.605 | smd 1.5 x 1.15: P4 -2.84,-6.4; P5 4.94,-6.4 | smd 1.16 x 1.25: SW 6.74,3.725
GCT_USB4110-GF-A_REVB = smd 0.6 x 1.15: A1/B12 -3.2,1.075; A4/B9 -2.4,1.075; B1/A12 3.2,1.075; B4/A9 2.4,1.075 | smd 0.3 x 1.15: A5 -1.25,1.075; A6 -0.25,1.075; A7 0.25,1.075; A8 1.25,1.075; B5 1.75,1.075; B6 0.75,1.075; B7 -0.75,1.075; B8 -1.75,1.075 | smd 2.18 x 2: S1 -5.11,0.5; S2 5.11,0.5; S3 -5.11,-3.43; S4 5.11,-3.43 | hole 0.65: -2.89,0; 2.89,0
LED_DUOLED-A-3MM = drill 0.8 pad 1.4: 1 -2.54,0; 2 0,0; 3 2.54,0
SOT23-R = smd 0.635 x 1.016: 1 -0.95,-1; 2 0.95,-1; 3 0,1
SOT23-3 = smd 0.8 x 0.9: 1 -0.95,-1; 2 0.95,-1; 3 0,1.1
0603-MINI = smd 0.9 x 0.9: 1 -0.75,0; 2 0.75,0
THUMBWHEEL = smd 1 x 4.5: 1 -4,-2.25 | smd 3 x 4.5: 3 -1,-2.25; 5 3,-2.25 | drill 1.6 square: P$6 -5,9; P$7 5,9
RETIRED_KPS-1290 = smd 0.7 x 1.5: O -2.25,2.25; P 0.75,2.25; S 2.25,2.25 | smd 1 x 0.8: P$1 -4.15,1.1; P$2 -4.15,-1.1; P$3 4.15,-1.1; P$4 4.15,1.1 | hole 0.9: -1.5,0; 1.5,0
START+SELECT-STANDARD = smd 1.4 x 1.4: P$ACTIVE 3,1; P$ACTIVE1 -1,1; P$ACTIVE2 -3,-1; P$ACTIVE3 1,-1; P$GND 1,1; P$GND1 -3,1; P$GND2 -1,-1; P$GND3 3,-1 | smd 2.54 x 0.285 rotated 45: P$ACTIVE4 -2,0 | smd 2.54 x 0.285 rotated 135: P$ACTIVE5 0,0 | smd 2.54 x 0.285 rotated 225: P$ACTIVE6 2,0
ESP32-WROVER_ESP32-WROVER = smd 1.7 x 0.9: CLK 18,1.27; CMD 0,1.27; EN 0,21.59; GND 0,24.13; GND3 18,24.13; GND_2 0,6.35; IO0 18,7.62; IO2 18,6.35; IO4 18,8.89; IO5 18,12.7; IO12 0,7.62; IO13 0,5.08; IO14 0,8.89; IO15 18,5.08; IO18 18,13.97; IO19 18,15.24; IO21 18,17.78; IO22 18,21.59; IO23 18,22.86; IO25 0,12.7; IO26 0,11.43; IO27 0,10.16; IO32 0,15.24; IO33 0,13.97; IO34 0,17.78; IO35 0,16.51; NC0 18,16.51; NC1 18,10.16; NC2 18,11.43; RXD0 18,19.05; SD0 18,2.54; SD1 18,3.81; SD2 0,3.81; SD3 0,2.54; SENSOR_VN 0,19.05; SENSOR_VP 0,20.32; TXD0 18,20.32; VDD33 0,22.86 | smd 4.5 x 4.5: GND2 7.62,16.34
SOT23-5 = smd 0.55 x 1.2: 1 -0.95,-1.3; 2 0,-1.3; 3 0.95,-1.3; 4 0.95,1.3; 5 -0.95,1.3
SOT23-5-1 = smd 0.55 x 1.2: 1 -0.95,-1.3; 2 0,-1.3; 3 0.95,-1.3; 4 0.95,1.3; 5 -0.95,1.3
SOIC8 = smd 0.6 x 2.2: 1 -1.905,-2.6; 2 -0.635,-2.6; 3 0.635,-2.6; 4 1.905,-2.6; 5 1.905,2.6; 6 0.635,2.6; 7 -0.635,2.6; 8 -1.905,2.6
KD026LQTMA008-PASSTHRU-2023 = smd 0.3 x 1.3 bottom: CS 3.5,13.61; DB00 -6,13.61; DB01 -5.5,13.61; DB02 -5,13.61; DB03 -4.5,13.61; DB04 -4,13.61; DB05 -3.5,13.61; DB06 -3,13.61; DB07 -2.5,13.61; DB08 -2,13.61; DB09 -1.5,13.61; DB10 -1,13.61; DB11 -0.5,13.61; DB12 0,13.61; DB13 0.5,13.61; DB14 1,13.61; DB15 1.5,13.61; DB16 2,13.61; DB17 2.5,13.61; DOTCLK 6,13.61; ENABLE 5.5,13.61; GND 11,13.61; GND2 10.5,13.61; GND3 -11,13.61; HSYNC 6.5,13.61; IM0 8,13.61; IM1 8.5,13.61; IM3 9,13.61; IOVCC 10,13.61; LEDA -8.5,13.61; LEDK1 -6.5,13.61; LEDK2 -7,13.61; LEDK3 -7.5,13.61; LEDK4 -8,13.61; RD 5,13.61; RESET 3,13.61; RS(SPI-SCL) 4,13.61; SDA 7.5,13.61; VCI 9.5,13.61; VSYNC 7,13.61; WR(SPI-RS) 4.5,13.61; XL -10,13.61; XR -9,13.61; YD -10.5,13.61; YU -9.5,13.61 | smd 2.5 x 2.2 bottom: PAD$1 -13.425,10.35; PAD$2 13.425,10.35
MGB-001-ESP32-2023 = hole 2.6: 67.6,107.8; 2.15,106.8; 1.9,63.8; 67.6,63.8; 67.1,29.15; 29.1,33.6; 22.7,22.4; 2.05,23.5 | hole 3.8: 56.6,31.1 | hole 2.2: 53.6,41.1; 23.7,27.2 | hole 3.5: 46.6,22.4
53261-02 = smd 0.8 x 2: 1 0.625,-2.5; 2 -0.625,-2.5 | smd 2.1 x 3: S1 3.125,0.625; S2 -3.125,0.625

### Placement (x,y rotation side)
A  62.97,39.7 180 top
B  48.92,35.21 180 top
C1  17,101.5 180 bottom
C2  24,105.5 0 bottom
C3  24,103.5 0 bottom
C4  13,107.5 0 bottom
C6  11,19.5 270 bottom
C7  26,51.5 0 bottom
C8  35,47 180 bottom
C9  20.59,47.5 90 bottom
C10  40,49.5 0 bottom
C13  17.05,95.5 180 bottom
C14  19,90.5 0 bottom
D4  13,105.5 0 bottom
DOWN  13.2,30.2 90 top
J1  40.1,4.5 90 top
J4  64,111.5 180 top
J5  10,8.25 180 bottom
J6  5.87,89.5 90 bottom
LED2  4.5,100 90 top
LEFT  6,37.4 0 top
Q3  13,102.5 180 bottom
Q4  19,87.5 270 bottom
Q5  19,79.5 270 bottom
R1  13,92.5 0 bottom
R2  20,108.5 90 bottom
R3  8,102 180 bottom
R4  8,98 0 bottom
R5  18,108.5 270 bottom
R6  19,92.5 180 bottom
R7  8,100 180 bottom
R9  18,83.5 270 bottom
R10  20,83.5 90 bottom
R11  23,58.5 180 bottom
R12  23,68.36 0 bottom
R13  23,70.36 0 bottom
R14  23,63.09 0 bottom
R15  23,65.09 0 bottom
R16  60,89.5 90 bottom
R17  11,75.5 270 bottom
R18  40,45 180 bottom
R19  22.5,47.5 270 bottom
R20  17.05,99.5 0 bottom
R21  17.05,97.5 180 bottom
R22  13,88.5 0 bottom
R24  13,90.5 0 bottom
RIGHT  20.4,37.4 180 top
S3  12,113.5 180 bottom
SELECT  30.05,16.51 0 top
START  41.66,16.51 0 top
U1  28.5,83.37 180 bottom
U3  24,108.5 90 bottom
U4  13,96.5 180 bottom
U6  29,47.5 90 bottom
U$11  36.75,84.5 0 top
U$17  1,0.5 0 top
UP  13.2,44.6 270 top
X2  50,7 90 bottom
X3  62.75,22.5 0 bottom

### Tracks (layer width: path | path; a pad name or v marks a point on that pad's centre or on a via)
3V3  (via drill 0.3)
  Top 0.508: 13.5,65 v20,58.5 24,58.5 v26,60.5 | 13.5,65 v13.5,72.5 | 13.5,65 v13.5,52 11.33,49.83 UP.P$GND | DOWN.P$GND 15.07,26.57 11,22.5 C6.2
  Top 0.61: v23,99.75 15.25,99.75 13.5,98 v13.5,72.5
  Bottom 0.508: R11.1 v20,58.5 | U1.VDD33 v26,60.5 | U6.1 23.66,45.59 R19.2 C9.1 18.75,46.75 v13.5,52 | J5.4 10.4,9.9 11,10.5 C6.2 | R17.5 v13.5,72.5
  other vias: 11,18.75
  pour Top (no thermals): 26.3,37.4 arc-90 13.2,24.3 arc-90 0.1,37.4 arc-90 13.2,50.5 arc-90
  pour Bottom (no thermals): 19,94.5 19,92 21,92 21,96.5 25,100.5 44.59,100.5 44.59,97.46 46.9,97.46 46.9,100.5 55.5,100.5 55.5,91 60,91 60,97.5 65,102.5 65,112.5 63,112.5 63,104.5 61,102.5 26,102.5 26,108 24,108 24,102.5 19.5,98 19.5,95
BACKLIGHT  (via drill 0.3)
  Top 0.295: v30,90.5 32,88.5 v58,88.5
  Bottom 0.295: U$11.LEDA 28.25,92.25 v30,90.5
  Bottom 0.508: R16.3 v58,88.5
BYP
  Bottom 0.508: U6.7 34.12,46.87 C8.1
CC1
  Bottom 0.254: J6.A5 12,88.25 R22.2
CC2
  Bottom 0.254: J6.B5 11.5,91.25 R24.2
DOWN  (via drill 0.3)
  Top 0.508: DOWN.P$ACTIVE 11.33,35.33 20,44 v20,51.5
  Bottom 0.508: v20,51.5 14,57.5 14,66.5 15.86,68.36 R12.2
DTR  (via drill 0.3)
  Top 0.61: v33,105.5 33,97.5 20,84.5 R10.1
  Bottom 0.508: Q5.2 20.05,78.5 21,78.5 22,79.5 22,81.5 20.75,82.75 R10.1
  Bottom 0.61: J4.6 51.3,105.8 51,105.5 v33,105.5
  other vias: 20,82.75
EN
  Bottom 0.508: R2.2 20.2,109.45 U3.3
GND  (via drill 0.3)
  other vias: 12,99.5 16.5,64.5 13,21.5 12.5,7 26.5,58 42.5,95 26,71.5 21,55.5
  pour Top (rank 2): 1,0.5 2,0.5 2,0 18,0 18,0.5 36.5,0.5 36.5,2.25 43.5,2.25 43.5,0.5 52.75,0.5 52.75,17.45 70.5,17.45 70.5,82 71.25,82 71.25,97 70.5,97 70.5,113.5 19,113.5 19,114.5 17.5,114.5 17.5,115 15,115 15,114.5 9,114.5 9,115 6.5,115 6.5,114.5 5,114.5 5,113.5 1,113.5 1,94.5 0,94.5 0,68 1,68
  pour Bottom (rank 6): 1,0.5 2,0.5 2,0 18,0 18,0.5 36.5,0.5 36.5,2.25 43.5,2.25 43.5,0.5 52.75,0.5 52.75,17.45 70.5,17.45 70.5,82 71.25,82 71.25,97 70.5,97 70.5,113.5 19,113.5 19,114.5 17.5,114.5 17.5,115 15,115 15,114.5 9,114.5 9,115 6.5,115 6.5,114.5 5,114.5 5,113.5 1,113.5 1,94.5 0,94.5 0,68 1,68
GPIO0  (via drill 0.3)
  Top 0.508: v24,75.75 v49,75.75
  Bottom 0.508: Q5.3 17.9,77.1 19.25,75.75 v24,75.75 | v49,75.75 U1.IO0
GPIO5
  Bottom 0.295: U$11.CS 40.25,91.25 43,88.5 50,88.5 51,87.5 51,72.5 49.17,70.67 U1.IO5
GPIO18  (via drill 0.3)
  Top 0.508: v41,63.5 41,59.5 38,56.5 35,56.5 29,50.5 v29,42.5
  Bottom 0.295: U$11.RS(SPI-SCL) 40.75,91.75 43,89.5 50,89.5 52,87.5 52,72.5 48.9,69.4 U1.IO18
  Bottom 0.508: J5.5 11.5,9 12,9.5 12,17.5 16,21.5 16,27.5 29,40.5 v29,42.5 | U1.IO18 42.9,69.4 41,67.5 v41,63.5
GPIO19  (via drill 0.3)
  Top 0.508: v42,63.5 42,58.5 39,55.5 36,55.5 30,49.5 v30,42.5
  Bottom 0.508: J5.7 13.7,11.8 13,12.5 13,16.5 17,20.5 17,26.5 30,39.5 v30,42.5 | U1.IO19 43.63,68.13 42,66.5 v42,63.5
GPIO21
  Bottom 0.295: U$11.WR(SPI-RS) 41.25,92.25 43,90.5 50,90.5 53,87.5 53,70.5 48.09,65.59 U1.IO21
GPIO22  (via drill 0.3)
  Top 0.508: v33,58.5 27,52.5 v27,42.5
  Bottom 0.508: J5.2 8.2,11.7 9,12.5 9,16.5 8,17.5 8,23.5 v27,42.5 | U1.IO22 37.28,61.78 34,58.5 v33,58.5
GPIO23  (via drill 0.3)
  Top 0.508: v34,57.5 28,51.5 v28,42.5
  Bottom 0.295: U$11.SDA 44.25,92.25 45,91.5 50,91.5 54,87.5 54,65.5 49.01,60.51 U1.IO23
  Bottom 0.508: J5.3 9.3,10.8 10,11.5 10,17.5 9,18.5 9,22.5 28,41.5 v28,42.5 | U1.IO23 38.01,60.51 35,57.5 v34,57.5
GPIO26  (via drill 0.3)
  Top 0.508: v30,57.5 v26,53.5
  Bottom 0.508: C7.2 25.25,52.75 v26,53.5 | U1.IO26 30.56,71.94 31,71.5 31,58.5 v30,57.5
GPIO27  (via drill 0.3)  (6 unrouted)
  Top 0.508: SELECT.P$ACTIVE 35,19.45 v35,50.5
  Bottom 0.508: U1.IO27 18.71,73.21 13,67.5 13,57 19.5,50.5 22,50.5 23,51.5 23,53.5 25,55.5 31,55.5 35,51.5 v35,50.5
GPIO32  (via drill 0.3)
  Top 0.508: v26,68.13 44.37,68.13 62.27,50.23 62.27,45 | 62.27,45 A.P$ACTIVE1 | A.P$ACTIVE 65.32,44.18 64.5,45 62.27,45
  Bottom 0.508: U1.IO32 v26,68.13
GPIO33  (via drill 0.3)
  Top 0.508: B.P$ACTIVE1 48.22,40.5 | 48.22,40.5 48.22,62.28 44,66.5 25,66.5 24,67.5 24,68.5 24.9,69.4 v26,69.4 | B.P$ACTIVE 51.27,40.23 51,40.5 48.22,40.5
  Bottom 0.508: U1.IO33 v26,69.4
GPIO34  (via drill 0.3)
  Top 0.508: LEFT.P$ACTIVE 5.73,39.5 14,39.5 18,43.5 18,55.5 v18,57.5
  Bottom 0.508: U1.IO34 24.25,65.59 R15.1 R14.1 23.75,62.25 22.5,61 20,61 18,59 v18,57.5
GPIO35  (via drill 0.3)
  Top 0.508: UP.P$ACTIVE 15,45.17 v15,58.5
  Bottom 0.508: 23.75,66.86 R12.1 R13.1 | 23.75,66.86 U1.IO35 | v15,58.5 15,65.5 16.36,66.86 23.75,66.86
GPIO36  (via drill 0.3)
  Top 0.508: v15,82.5 15,79 19,75 19,64.5 20.45,63.05 v26.5,63.05
  Bottom 0.508: R20.1 R21.2 C13.2 17.8,94.8 15,92 v15,82.5 | U1.SENSOR_VP v26.5,63.05
GPIO39  (via drill 0.3)  (6 unrouted)
  Top 0.508: START.P$ACTIVE2 36,18.16 v36,51.5
  Bottom 0.508: v36,51.5 36,52.5 32,56.5 24.75,56.5 23.75,57.5 R11.2 23.75,60.75 25.5,62.5 25.5,64 25.82,64.32 U1.SENSOR_VN
HEADPHONES  (via drill 0.3)
  Top 0.508: v37,44.5 38,44.5 v39.5,43 | v24,47 26,45 v26,44 | v34,44.5 33,43.5 v31,43.5
  Bottom 0.508: R19.1 22.61,48.13 24,48.13 | U6.3 24,48.13 | 24,48.13 v24,47 | v37,44.5 v34,44.5 | v39.5,43 40,42.5 40,20.5 | J1.RSH 37.6,19.1 39,20.5 40,20.5 | J1.TSH 42.6,17.9 40,20.5 | v26,44 30.5,44 v31,43.5
POWER_LED  (via drill 0.3)
  Top 0.508: v18,111 10.5,111 4.5,105 LED2.3
  Bottom 0.508: R5.1 v18,111
PROG
  Bottom 0.508: U4.5 12.25,95 R1.2
RESET  (via drill 0.3)
  Top 0.508: v26.5,61.78 19.72,61.78 18,63.5 v18,74.5
  Bottom 0.295: U$11.RESET 39.75,91.25 37.95,89.35 18.25,89.35
  Bottom 0.508: C14.2 18.25,89.35 18.25,87.85 Q4.3 16.5,86.1 16.5,76 v18,74.5 | U1.EN v26.5,61.78
  Bottom 0.61: C14.2 R6.1
RIGHT  (via drill 0.3)
  Top 0.508: RIGHT.P$ACTIVE 18,38.43 18,40.5 21,43.5 21,46.5 v21,51.5
  Bottom 0.508: v21,51.5 21,52.5 17,56.5 17,61.5 18.59,63.09 R14.2
RST-RES
  Bottom 0.508: Q4.1 21.05,88.45 22,87.5 22,85.5 20.75,84.25 R10.2
RTS  (via drill 0.3)
  Top 0.61: v31,104 31,97.5 20,86.5 Q4.2
  Bottom 0.508: Q4.2 19.05,86.55 18,85.5 R9.1
  Bottom 0.61: J4.5 53.84,104.34 53.5,104 v31,104
  other vias: 20,86.55
RTS-RES
  Bottom 0.508: R9.2 18,81.5 19.05,80.45 Q5.1
RXD0  (via drill 0.3)
  Top 0.61: J4.3 61,109.42 61,81.5 53,73.5 v53,68.5
  Bottom 0.61: U1.RXD0 48.82,64.32 v53,68.5
SOURCE
  Bottom 0.508: S3.P 12.75,109.25 13.75,108.25 C4.1 13.75,105.5 D4.C 13.95,105.5 Q3.2
STAT
  Bottom 0.508: U4.1 11.85,98 R4.1 8.75,98.75 8.5,99 7.5,99 7.25,99.25 R7.1
STAT_LED
  Bottom 0.508: R4.2 6.71,97.46 LED2.1
SUPPLY
  Bottom 0.508: S3.S 14.25,109.25 15.75,107.75 R5.2 R2.1 20.2,107.55 U3.1
TXD0  (via drill 0.3)
  Top 0.61: v51,64.5 51,73.5 60,82.5 60,107.88 J4.4
  Bottom 0.61: U1.TXD0 49.55,63.05 v51,64.5
VBAT  (via drill 0.3)
  Top 0.508: v15,93.5 17,91.5 17,79.5 20,76.5 20,67.5 22,65.5 43,65.5 46,62.5 v46,48.5
  Bottom 0.508: 13.95,100.5 U4.3 13.95,97.55 15,96.5 v15,93.5 | C1.1 16.25,100.5 | 13.95,100.5 16.25,100.5 | 16.25,100.5 16.25,99.5 R20.2 | 13.95,100.5 13,100.5 Q3.3 | v46,48.5 49,45.5 55,45.5 62.12,38.38 X3.1
VBUS  (via drill 0.3)
  Top 0.508: v10,103.5 v10,93.5 v10,85.5
  Bottom 0.508: J6.A4/B9 8.4,87.1 v10,85.5 | J6.B4/A9 8.4,91.9 v10,93.5 10,95.5 11,96.5 13.5,96.5 13.95,96.05 U4.4
  pour Bottom (no thermals): 10,106.25 12.5,106.25 12.5,102.5 12,102 12,101.5 10,99.6 8,99.6 8,103.97
VIN
  Bottom 0.508: U6.2 28,46.87 28.25,46.87 28.36,46.87 29,47.5 29,50.5 28,51.5 C7.1
VIN1
  Top 0.508: J1.RING 35,11.5 36,12.5 44,12.5 45.2,11.3 J1.TIP
  Bottom 0.508: C10.- 41.48,45.73 R18.2 40.75,21.75 45.2,17.3 J1.TIP
VOLUME
  Bottom 0.508: R17.3 10,76.5 9,75.5 9,59.5 19,49.5 26.3,49.5 U6.4
VOUT1
  Bottom 0.508: U6.5 38,49.41 | 38,49.41 38.43,49.41 C10.+ | X2.1 32.38,7.62 31,9 31,14 39,22 39,42 38,43 38,49.41
VOUT2
  Bottom 0.508: U6.8 31.6,44.9 34,42.5 34,19.5 30,15.5 30,8.5 32.12,6.38 X2.2

### Text on the board
tNames: DTR | RTS | RXD | TXD | GND | VCC | A | B | SELECT | START
bNames: DTR | RTS | RXD | TXD | GND | VCC | ! | RED WIRE | BLACK WIRE | ⇪ | ⇪
Reference: Credits: / Name: Eugene Yevhen Andruszczenko / GitHub: 32teeth